# EAGLE schematic MotherBoard (EAGLE 9.3.0)
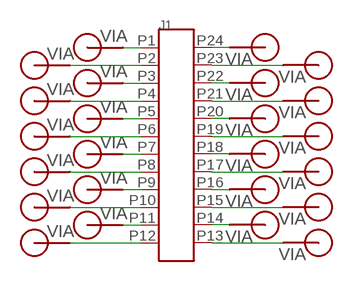
[diagram p0: schematic, sheet 1]

## Parts
J1  EBM12DRXH  [EBM12DRXH]
V1  VIA60MIL-SQ  [VIA-60MIL-SQ]
V2  VIA60MIL-SQ  [VIA-60MIL-SQ]
V3  VIA60MIL-SQ  [VIA-60MIL-SQ]
V4  VIA60MIL-SQ  [VIA-60MIL-SQ]
V5  VIA60MIL-SQ  [VIA-60MIL-SQ]
V6  VIA60MIL-SQ  [VIA-60MIL-SQ]
V7  VIA60MIL-SQ  [VIA-60MIL-SQ]
V8  VIA60MIL-SQ  [VIA-60MIL-SQ]
V9  VIA60MIL-SQ  [VIA-60MIL-SQ]
V10  VIA60MIL-SQ  [VIA-60MIL-SQ]
V11  VIA60MIL-SQ  [VIA-60MIL-SQ]
V12  VIA60MIL-SQ  [VIA-60MIL-SQ]
V13  VIA60MIL-SQ  [VIA-60MIL-SQ]
V14  VIA60MIL-SQ  [VIA-60MIL-SQ]
V15  VIA60MIL-SQ  [VIA-60MIL-SQ]
V16  VIA60MIL-SQ  [VIA-60MIL-SQ]
V17  VIA60MIL-SQ  [VIA-60MIL-SQ]
V18  VIA60MIL-SQ  [VIA-60MIL-SQ]
V19  VIA60MIL-SQ  [VIA-60MIL-SQ]
V20  VIA60MIL-SQ  [VIA-60MIL-SQ]
V21  VIA60MIL-SQ  [VIA-60MIL-SQ]
V22  VIA60MIL-SQ  [VIA-60MIL-SQ]
V23  VIA60MIL-SQ  [VIA-60MIL-SQ]
V24  VIA60MIL-SQ  [VIA-60MIL-SQ]

## Nets
N$1: J1.P1 V1.P$1
N$2: J1.P2 V2.P$1
N$3: J1.P3 V3.P$1
N$4: J1.P4 V4.P$1
N$5: J1.P5 V5.P$1
N$6: J1.P6 V6.P$1
N$7: J1.P7 V7.P$1
N$8: J1.P8 V8.P$1
N$9: J1.P9 V9.P$1
N$10: J1.P10 V10.P$1
N$11: J1.P11 V11.P$1
N$12: J1.P12 V12.P$1
N$13: J1.P13 V13.P$1
N$14: J1.P14 V14.P$1
N$15: J1.P15 V15.P$1
N$16: J1.P16 V16.P$1
N$17: J1.P17 V17.P$1
N$18: J1.P18 V18.P$1
N$19: J1.P19 V19.P$1
N$20: J1.P20 V20.P$1
N$21: J1.P21 V21.P$1
N$22: J1.P22 V22.P$1
N$23: J1.P23 V23.P$1
N$24: J1.P24 V24.P$1

## Library data of the parts
J1 = FutureSat:EBM12DRXH
V1-V24 = BrownSpaceEngineering:VIA